# EAGLE design hackdice (EAGLE 5.12)
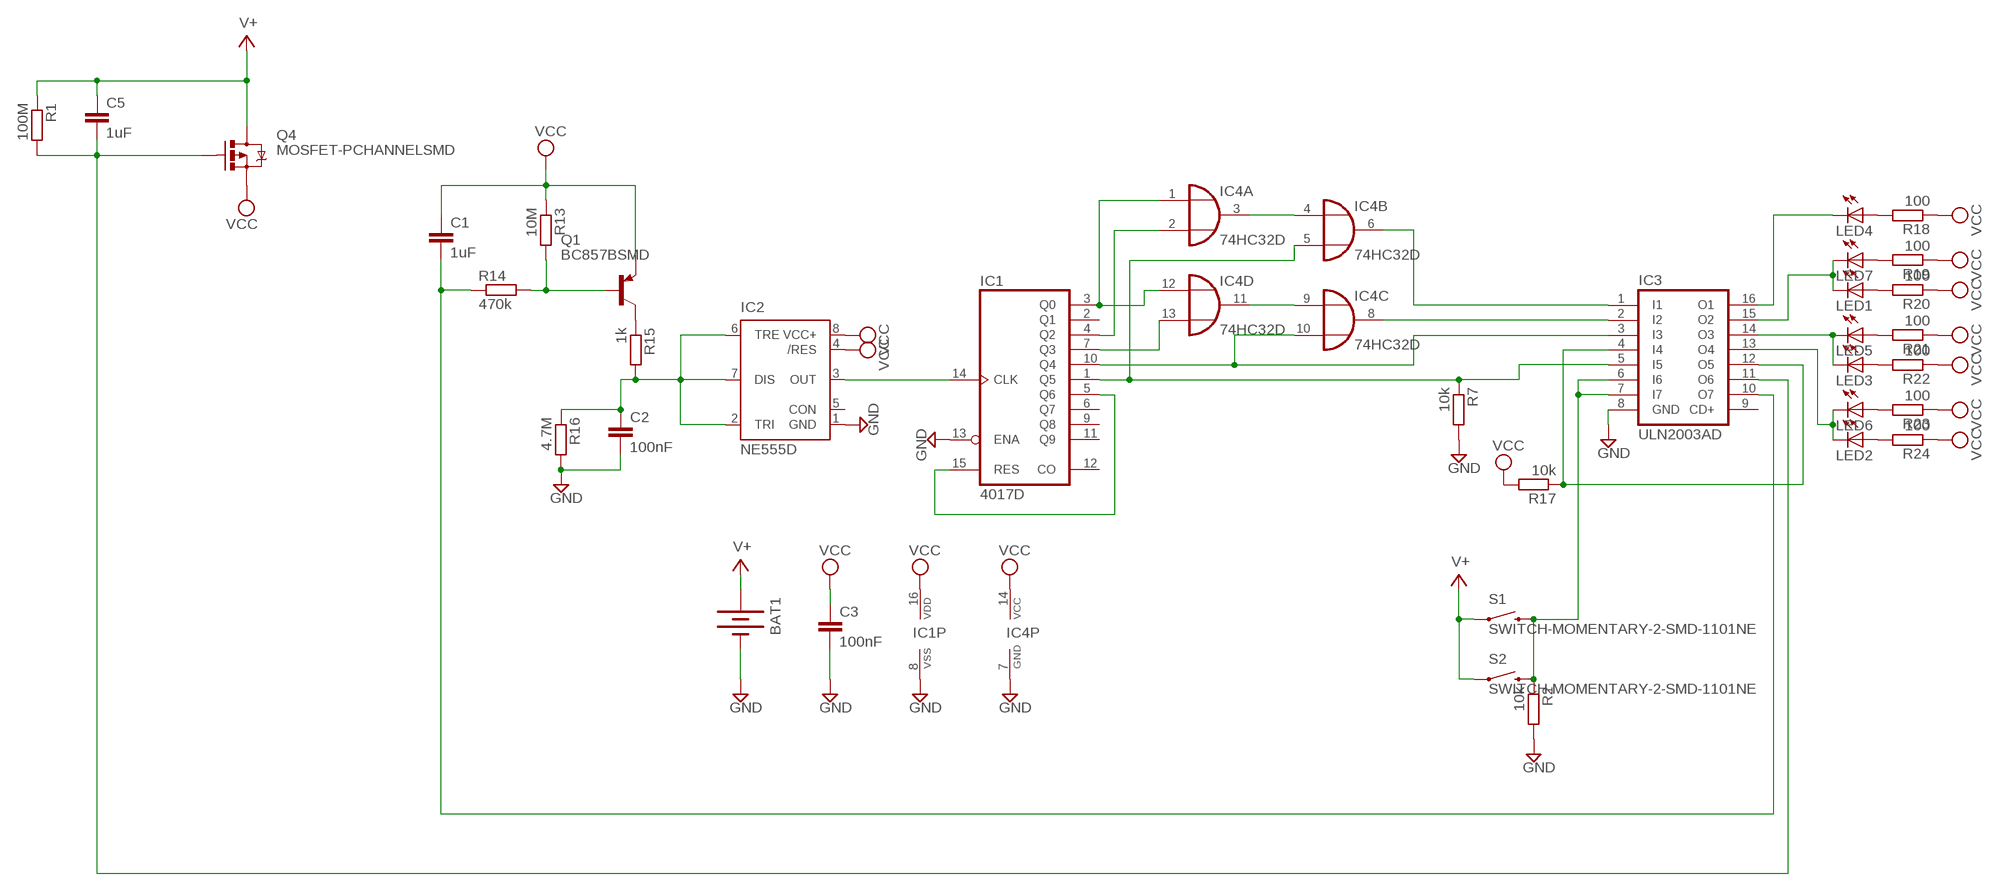
[diagram p0: schematic, sheet 1]

## Parts
BAT1  BATTERY20PTH  [BATTCOM_20MM_PTH]
C1  1uF  C-EUC0805K  [C0805K]
C2  100nF  C-EUC0805K  [C0805K]
C3  100nF  C-EUC0805K  [C0805K]
C5  1uF  C-EUC0805K  [C0805K]
IC1  4017D  [SO16]
IC2  NE555D  [SO08]
IC3  ULN2003AD  [SO16]
IC4  74HC32D  [SO14]
LED1  LED1206  [LED-1206]
LED2  LED1206  [LED-1206]
LED3  LED1206  [LED-1206]
LED4  LED1206  [LED-1206]
LED5  LED1206  [LED-1206]
LED6  LED1206  [LED-1206]
LED7  LED1206  [LED-1206]
Q1  BC857BSMD  [SOT23-BEC]
Q4  MOSFET-PCHANNELSMD  [SOT23-3]
R1  100M  R-EU_R0805  [R0805]
R2  10k  R-EU_R0805  [R0805]
R7  10k  R-EU_R0805  [R0805]
R13  10M  R-EU_R0805  [R0805]
R14  470k  R-EU_R0805  [R0805]
R15  1k  R-EU_R0805  [R0805]
R16  4.7M  R-EU_R0805  [R0805]
R17  10k  R-EU_R0805  [R0805]
R18  100  R-EU_R0805  [R0805]
R19  100  R-EU_R0805  [R0805]
R20  100  R-EU_R0805  [R0805]
R21  100  R-EU_R0805  [R0805]
R22  100  R-EU_R0805  [R0805]
R23  100  R-EU_R0805  [R0805]
R24  100  R-EU_R0805  [R0805]
S1  SWITCH-MOMENTARY-2-SMD-1101NE  [TACTILE-SWITCH-1101NE]
S2  SWITCH-MOMENTARY-2-SMD-1101NE  [TACTILE-SWITCH-1101NE]

## Nets
GND: BAT1.2(-) C2.2 C3.2 IC1.8(VSS) IC1.13(ENA) IC2.1(GND) IC3.8(GND) IC4.7(P:GND) R2.2 R7.2 R16.2
N$1: IC1.3(Q0) IC4.1(A:I0) IC4.12(D:I0)
N$2: IC1.4(Q2) IC4.2(A:I1)
N$3: IC3.6(I6) IC3.7(I7) R2.1 S1.P$2 S2.P$2
N$4: IC3.2(I2) IC4.8(C:O)
N$5: IC1.7(Q3) IC4.13(D:I1)
N$6: IC4.3(A:O) IC4.4(B:I0)
N$7: IC1.5(Q6) IC1.15(RES)
N$8: IC3.16(O1) LED4.C
N$9: IC3.15(O2) LED1.C LED7.C
N$10: IC3.14(O3) LED3.C LED5.C
N$11: IC3.13(O4) LED2.C LED6.C
N$12: LED4.A R18.2
N$13: LED7.A R19.2
N$14: LED1.A R20.2
N$15: IC3.1(I1) IC4.6(B:O)
N$16: IC1.10(Q4) IC3.3(I3) IC4.10(C:I1)
N$17: IC4.9(C:I0) IC4.11(D:O)
N$18: IC3.4(I4) IC3.12(O5) R17.1
N$19: IC1.14(CLK) IC2.3(OUT)
N$20: Q1.B R13.2 R14.2
N$22: LED5.A R21.2
N$23: Q1.C R15.1
N$24: C2.1 IC2.2(TRI) IC2.6(TRE) IC2.7(DIS) R15.2 R16.1
N$25: LED3.A R22.2
N$26: LED6.A R23.2
N$27: LED2.A R24.2
N$29: IC1.1(Q5) IC3.5(I5) IC4.5(B:I1) R7.1
N$30: C1.2 IC3.10(O7) R14.1
N$31: C5.2 IC3.11(O6) Q4.1(G) R1.2
V+: BAT1.1(+) C5.1 Q4.3(D) R1.1 S1.P$1 S2.P$1
VCC: C1.1 C3.1 IC1.16(VDD) IC2.4(/RES) IC2.8(VCC+) IC4.14(P:VCC) Q1.E Q4.2(S) R13.1 R17.2 R18.1 R19.1 R20.1 R21.1 R22.1 R23.1 R24.1
Unconnected: IC1.2(Q1) IC1.6(Q7) IC1.9(Q8) IC1.11(Q9) IC1.12(CO) IC2.5(CON) IC3.9(CD+)

## Library data of the parts
BAT1 = SparkFun:BATTERY: Battery Holders Various common sizes : AA, AAA, 20mm coin cell and 12mm coin cell.
C1-C3 C5 = rcl:C-EU: CAPACITOR, European symbol
IC1 = 40xx:4017: COUNTER/DIVIDER
IC2 = SparkFun:NE555: General purpose bipolar Timer
IC3 = uln-udn:ULN2003A: DRIVER ARRAY
IC4 = 74xx-eu:74*32: Quad 2-input OR gate
LED1-LED7 = SparkFun:LED: LEDs Standard schematic elements and footprints for 5mm, 3mm, 1206, and 0603 sized LEDs. 5mm - Spark Fun Electronics SKU : COM-00529 (and others)
Q1 = transistor-pnp:BC857*: PNP Transistror
Q4 = SparkFun:MOSFET-PCHANNEL
R1 R2 R7 R13-R24 = rcl:R-EU_: RESISTOR, European symbol
S1 S2 = SparkFun:SWITCH-MOMENTARY-2

## Board
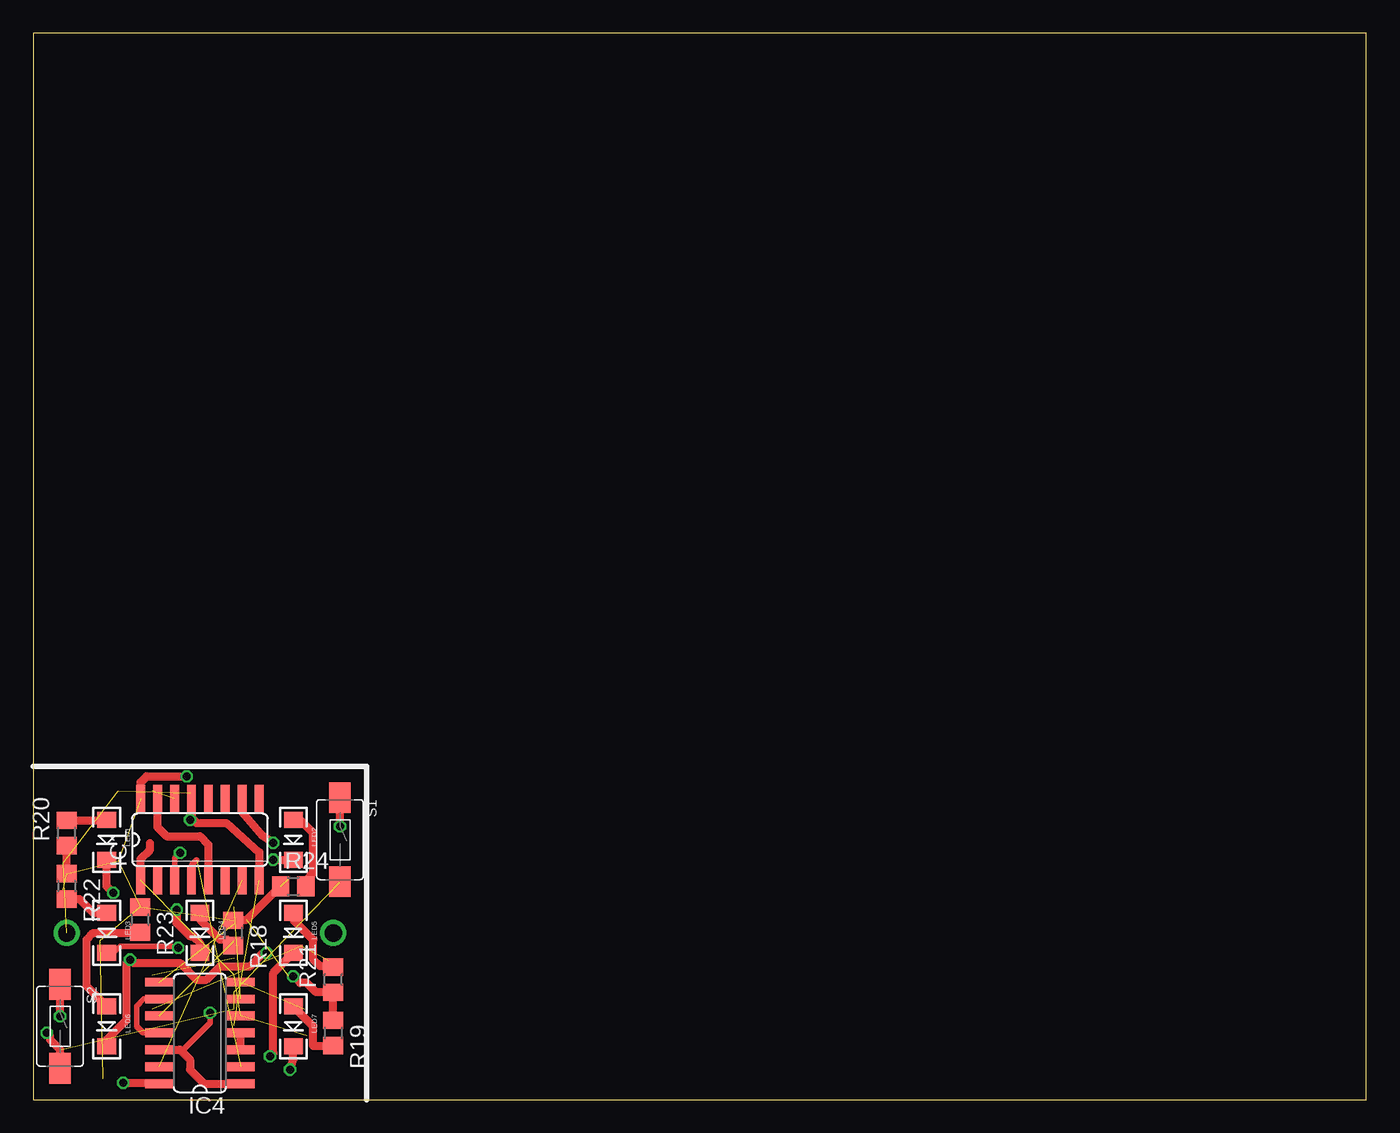
[diagram p1: board, top side]
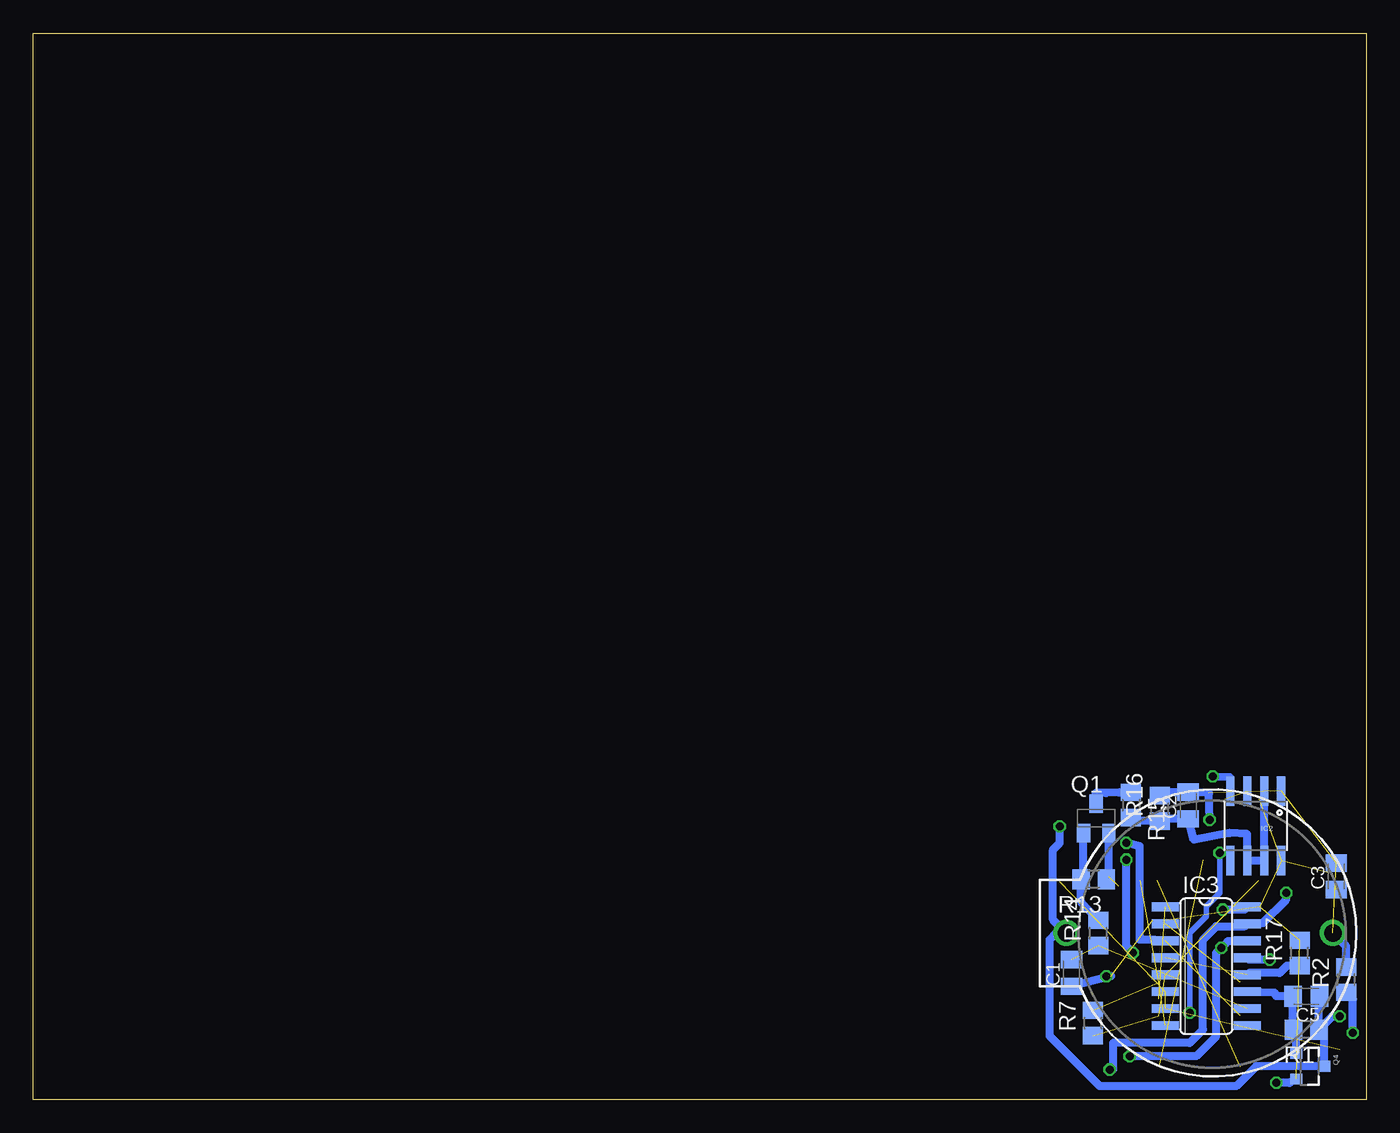
[diagram p2: board, bottom side, seen from below]

Size 100 x 80 mm. Coordinates in mm from the lower left corner, seen from the top.
Outline: 0,0 100,0 100,80 0,80 0,0
Copper layers (1*16): Top 0.035mm / dielectric 0.2mm / Bottom 0.035mm
Design rules "SeeedStudio_DRU_no_angle_20130527 *": minimum track width 6mil, minimum drill 12mil, track to track 6mil, track to pad 6mil, pad to pad 6mil, via to via 6mil, smd to smd 0mil, copper to edge 10mil, drill to drill 10mil, minimum pad ring 6mil, minimum via ring 6mil, stop-mask expansion 2mil, vias tented up to drill 25mil, thermal gap 10mil

### Footprints (pad centres in the part's own frame; a part is rotated, then mirrored left to right if it is on the bottom)
BATTCOM_20MM_PTH = drill 1.3 round: 1 20,0; 2 0,0
C0805K = smd 1.3 x 1.6: 1 -1,0; 2 1,0
SO16 = smd 0.66 x 2.032: 1 -4.445,-3.073; 2 -3.175,-3.073; 3 -1.905,-3.073; 4 -0.635,-3.073; 5 0.635,-3.073; 6 1.905,-3.073; 7 3.175,-3.073; 8 4.445,-3.073; 9 4.445,3.073; 10 3.175,3.073; 11 1.905,3.073; 12 0.635,3.073; 13 -0.635,3.073; 14 -1.905,3.073; 15 -3.175,3.073; 16 -4.445,3.073
SO08 = smd 0.61 x 2.21: 1 -1.905,-2.616; 2 -0.635,-2.616; 3 0.635,-2.616; 4 1.905,-2.616; 5 1.905,2.616; 6 0.635,2.616; 7 -0.635,2.616; 8 -1.905,2.616
SO14 = smd 0.66 x 2.032: 1 -3.81,-3.073; 2 -2.54,-3.073; 3 -1.27,-3.073; 4 0,-3.073; 5 1.27,-3.073; 6 2.54,-3.073; 7 3.81,-3.073; 8 3.81,3.073; 9 2.54,3.073; 10 1.27,3.073; 11 0,3.073; 12 -1.27,3.073; 13 -2.54,3.073; 14 -3.81,3.073
LED-1206 = smd 1.2 x 1.4: A -1.5,0; C 1.5,0
SOT23-BEC = smd 1 x 1.4: B -0.95,-1.1; C 0,1.1; E 0.95,-1.1
SOT23-3 = smd 0.8 x 0.9: 1 -0.95,-1; 2 0.95,-1; 3 0,1.1
R0805 = smd 1.3 x 1.5: 1 -0.95,0; 2 0.95,0
TACTILE-SWITCH-1101NE = smd 2.3 x 1.6: P$1 -3.15,0; P$2 3.15,0

### Placement (x,y rotation side)
BAT1  2.5,12.5 180 bottom
C1  22.11,9.5 90 bottom
C2  13.36,22.06 90 bottom
C3  2.25,16.75 90 bottom
C5  4.5,7.75 180 bottom
IC1  12.5,19.5 0 top
IC2  8.29,20.53 180 bottom
IC3  12,10 270 bottom
IC4  12.5,5 90 top
LED1  5.5,19.5 270 top
LED2  19.5,19.5 270 top
LED3  5.5,12.5 270 top
LED4  12.5,12.5 270 top
LED5  19.5,12.5 270 top
LED6  5.5,5.5 270 top
LED7  19.5,5.5 270 top
Q1  20.26,21.1 0 bottom
Q4  4.25,2.5 270 bottom
R1  4.5,5.25 180 bottom
R2  1.5,9 90 bottom
R7  20.5,5.75 90 bottom
R13  20.44,16.53 180 bottom
R14  20.11,12.49 90 bottom
R15  17.64,22.09 270 bottom
R16  15.47,21.84 90 bottom
R17  5,11 90 bottom
R18  15,12.5 270 top
R19  22.5,5 270 top
R20  2.5,20 90 top
R21  22.5,9 90 top
R22  2.5,16 270 top
R23  8,13.5 270 top
R24  19.5,16 0 top
S1  23,19.5 270 top
S2  2,5.5 270 top

### Tracks (layer width: path | path; a pad name or v marks a point on that pad's centre or on a via)
GND  (via drill 0.6)  (6 unrouted)
  Top 0.61: IC1.8 16.95,18.55 14.5,20.75 12.25,20.75 11.87,21.14 IC1.13 11.87,21.36 v11.75,21
  Bottom 0.61: v11.75,21 11.8,23 C2.2 14.88,23.04 R16.2 | R2.2 1.5,11.5 BAT1.2
N$1  (via drill 0.6)
  Top 0.406: IC1.3 10.6,18.09 v11,18.5 | v13.25,6.5 13.25,5.75 11.12,3.62
  Top 0.61: IC4.1 12.81,1.19 11.75,2.25 11.75,3 11.12,3.62 11,3.75 9.45,3.75 IC4.12
  Bottom 0.406: v11,18.5 11,15.5 12,14.5 12,13.75 13.25,12.5 v13.25,6.5
N$2  (1 unrouted)
  Top 0.406: IC1.4 11.87,17.61 12.25,18
N$3  (via drill 0.6)  (3 unrouted)
  Top 0.61: S2.P$2 2,3.75 1.25,4.5 1.25,4.75 v1,5
  Bottom 0.61: v1,5 1,7.55 R2.1
N$4  (1 unrouted)
N$5  (1 unrouted)
N$6
  Top 0.61: IC4.3 IC4.4
N$7
  Top 0.61: IC1.15 9.32,20.43 10,19.75 12.5,19.75 13.13,19.11 IC1.5
N$8  (via drill 0.6)
  Top 0.61: LED4.C 12.5,11.75 12,12.25 11.75,12.25 10.75,13.25 v10.75,14.25
  Bottom 0.61: v10.75,14.25 9.12,14.25 IC3.16
N$9  (via drill 0.6)
  Top 0.61: LED1.C 5.5,16 v6,15.5 | LED7.C 19.5,3 v19.25,2.25
  Bottom 0.61: v6,15.5 6,15 7.75,13.25 8.85,13.25 IC3.15 9.1,13 11.25,13 12.25,12 12.25,5.25 13.25,4.25 19,4.25 19,2.25 v19.25,2.25
N$10  (via drill 0.6)
  Top 0.406: LED3.C 6,11 6.5,11.5 10.75,11.5 v10.88,11.38
  Top 0.61: LED5.C 18,9.5 18,3.5 v17.75,3.25
  Bottom 0.61: v17.75,3.25 12.75,3.25 11.25,4.75 11.25,11 v10.88,11.38 10.62,11.62 10.35,11.9 IC3.14
N$11  (via drill 0.6)
  Top 0.61: LED6.C 5.5,4.5 7,6 7,10.25 v7.25,10.5 7.5,10.25 11,10.25 12.25,9 13,9 14,10 16.25,10 17.25,11 v17.5,11 | v18,18 LED2.C
  Bottom 0.61: v7.25,10.5 8.79,10.5 IC3.13 | v18,18 18,11.5 v17.5,11
N$12
  Top 0.61: LED4.A 12.5,13.5 14,12 14.55,12 R18.2
N$13
  Top 0.61: R19.2 22.5,4 21,4 21,5.5 LED7.A
N$14
  Top 0.61: R20.2 5.45,20.95 LED1.A
N$15  (1 unrouted)
N$16  (via drill 0.6)  (1 unrouted)
  Top 0.61: IC1.10 15.68,21.57 17.25,19.75 v18,19.25
  Bottom 0.61: v18,19.25 17,19 17,12 15.92,12 IC3.3
N$17
  Top 0.406: IC4.9 8.29,7.54 7.75,7 7.75,5.5 8.25,5 IC4.11
N$18  (1 unrouted)
  Bottom 0.61: R17.1 5.95,10.05 6.5,9.5 8.79,9.5 IC3.12
N$19  (1 unrouted)
N$20
  Bottom 0.61: Q1.B 21.21,16.71 R13.2 21.39,14.84 R14.2
N$22
  Top 0.61: LED5.A 19.5,13.5 21,12 21,10.5 21.5,10 22.45,10 R21.2
N$23
  Bottom 0.61: R15.1 18.54,23.04 19.5,23 20.31,23 Q1.C
N$24
  Bottom 0.61: IC2.2 IC2.7 IC2.6 8.93,19.93 10.25,20 12.92,19.5 C2.1 15.05,21.06 R16.1 17.14,20.89 R15.2
N$25
  Top 0.61: R22.2 3.45,15.05 4.5,14 LED3.A
N$26
  Top 0.61: R23.2 7.5,12.5 4.5,12.5 4,12 4,8.5 LED6.A
N$27
  Top 0.61: R24.2 20.45,16.45 21,17 21,20 20,21 LED2.A
N$29  (3 unrouted)
  Top 0.61: IC1.1 8.05,18.05 8.75,18.75 8.75,19.25
N$30  (2 unrouted)
N$31
  Bottom 0.61: Q4.1 5.25,5.05 R1.2 5.5,5.3 C5.2 6.75,7.75 6.83,8 IC3.11
V+  (via drill 0.6)
  Top 0.61: v23,20.5 S1.P$1 | v2,6.25 S2.P$1
  Bottom 0.61: v23,20.5 23,19.25 23.5,18.75 23.5,13.5 BAT1.1 23.25,12.5 23.75,12 23.75,4.75 20,1 9.75,1 8.25,2.5 Q4.3 3.15,4.85 R1.1 | v2,6.25 2.55,6.25 R1.1 | R1.1 3.55,7.7 C5.1
VCC  (via drill 0.6)  (9 unrouted)
  Top 0.61: R22.1 R20.1 | R19.1 R21.1 21.2,8.05 20.5,8.75 20,8.75 v19.5,9.25 | R24.1 18.5,16 16,13.5 15.05,13.5 R18.1 | v6.75,1.25 9.37,1.25 IC4.14 | IC1.16 8.05,23.8 8.5,24.25 v11.5,24.25
  Bottom 0.61: v19.5,9.25 19.14,9.25 C1.1 | Q4.2 5.75,1.25 v6.75,1.25 | Q1.E 19.31,16.71 R13.1 | v11.5,24.25 10.25,24.2 IC2.4